# Altium schematic sheet msp430.SchDoc
size A4
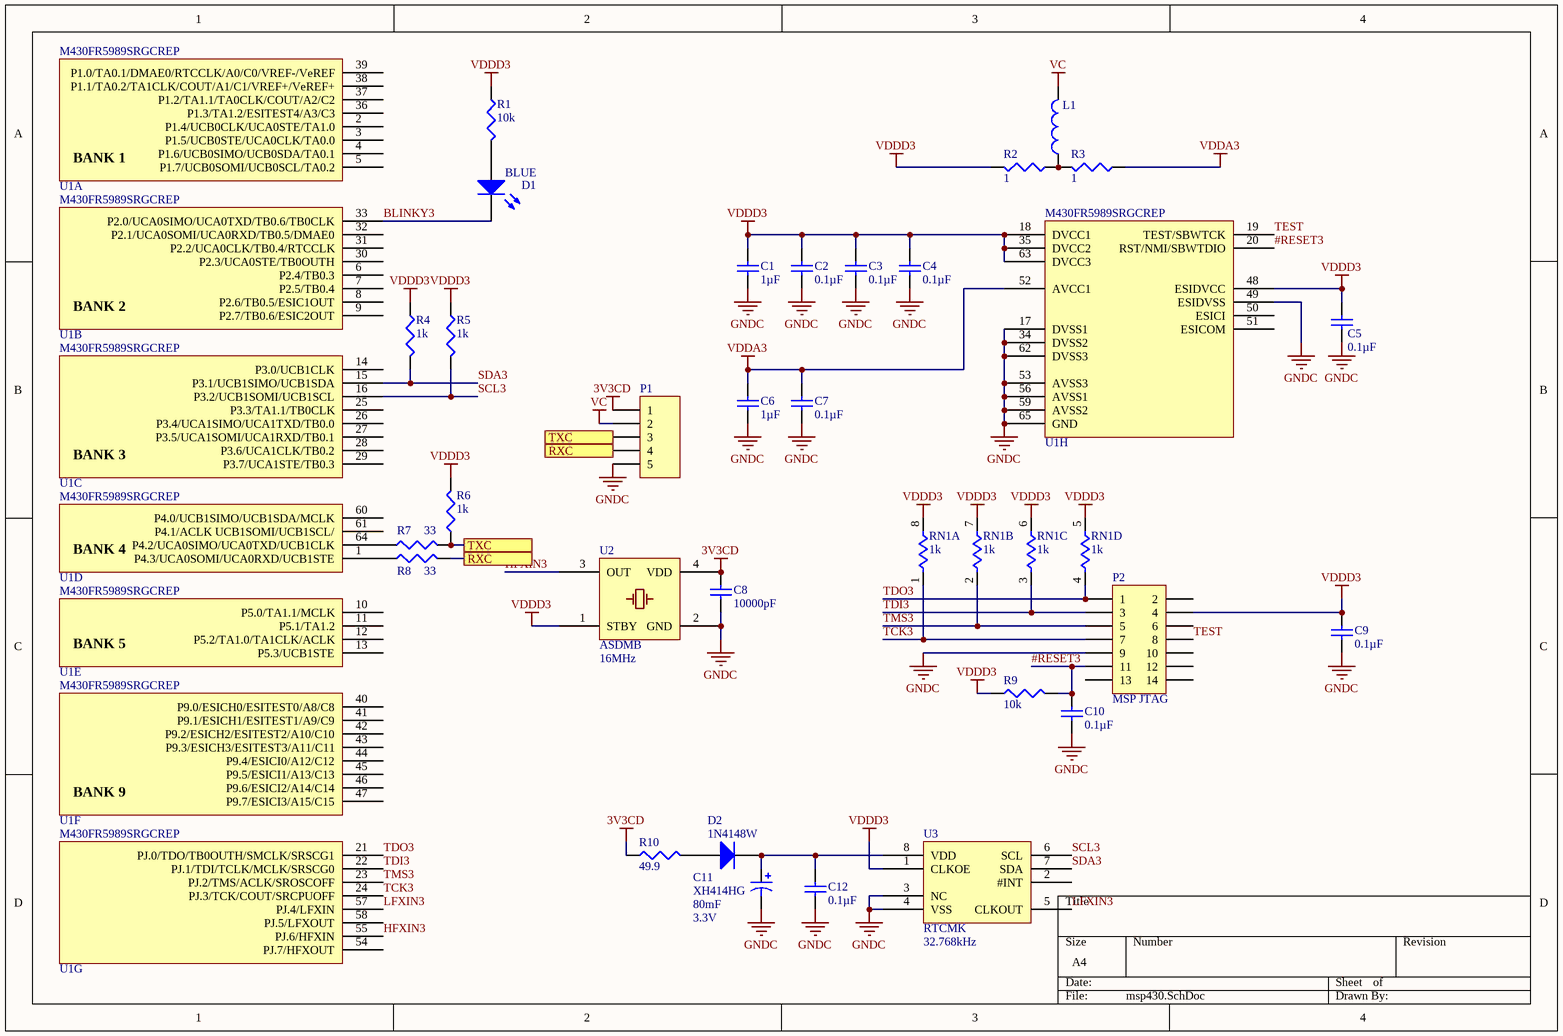
[diagram p0: msp430.SchDoc]

## Parts
C1  value 1µF  [TDK-CGA3E]  (hidden comment: Cap)
C2  value 0.1µF  [TDK-CGA3E]  (hidden comment: Cap)
C3  value 0.1µF  [TDK-CGA3E]  (hidden comment: Cap)
C4  value 0.1µF  [TDK-CGA3E]  (hidden comment: Cap)
C5  value 0.1µF  [TDK-CGA3E]  (hidden comment: Cap)
C6  value 1µF  [TDK-CGA3E]  (hidden comment: Cap)
C7  value 0.1µF  [TDK-CGA3E]  (hidden comment: Cap)
C8  value 10000pF  [TDK-CGA3E]  (hidden comment: Cap)
C9  value 0.1µF  [TDK-CGA3E]  (hidden comment: Cap)
C10  value 0.1µF  [TDK-CGA3E]  (hidden comment: Cap)
C11  XH414HG  value 80mF  Voltage - Rated: 3.3V  [SKI-XH414HG-IV01E]
C12  value 0.1µF  [TDK-CGA3E]  (hidden comment: Cap)
D1  value BLUE  [WL-150060XS75000]  (hidden comment: LED)
D2  1N4148W  [DIOD-SOD123]
L1  Inductor  [TDK-MPX1608]  (value not drawn)
P1  319-10-105-30-054000  [319-10-105-30-054000]  (value not drawn)
P2  Header 7x2  [SLN-GRPB072]  (value not drawn)
R1  value 10k  [PANA-ERJ3EK]  (hidden comment: Res3)
R2  value 1  [VSH-0603MCT]  (hidden comment: Res3)
R3  value 1  [VSH-0603MCT]  (hidden comment: Res3)
R4  value 1k  [PANA-ERJ3EK]  (hidden comment: Res3)
R5  value 1k  [PANA-ERJ3EK]  (hidden comment: Res3)
R6  value 1k  [PANA-ERJ3EK]  (hidden comment: Res3)
R7  value 33  [PANA-ERJ3EK]  (hidden comment: Res3)
R8  value 33  [PANA-ERJ3EK]  (hidden comment: Res3)
R9  value 10k  [PANA-ERJ3EK]  (hidden comment: Res3)
R10  value 49.9  [PANA-ERJ3EK]  (hidden comment: Res3)
RN1  value 1k  [PANA-EXB1206]  (hidden comment: Res4 Pack1)  (parts A,B,C,D of 4)
U1  Manufacturer Part Number: M430FR5989SRGCREP  [TI-RGC]  (hidden comment: MSP430FR5989)  (parts A,B,C,D,E,F,G,H of 8)
U2  ASDMB  value 16MHz  [ABR-ASDMB]
U3  RTCMK  value 32.768kHz  [ABR-RTCMK]

## Ports
RXC, TXC

## Nets
3V3CD: C8.2 P1.1 R10.2 U2.4(VDD)
GNDC: C1.1 C2.1 C3.1 C4.1 C5.1 C6.1 C7.1 C8.1 C9.1 C10.2 C11.2 C12.1 P1.5 P2.9 U1.17(DVSS1) U1.34(DVSS2) U1.49(ESIDVSS) U1.53(AVSS3) U1.56(AVSS1) U1.59(AVSS2) U1.62(DVSS3) U1.65(GND) U2.2(GND) U3.3(NC) U3.4(VSS)
VC: L1.2 P1.2
VDDA3: C6.2 C7.2 R3.1 U1.52(AVCC1)
VDDD3: C1.2 C2.2 C3.2 C4.2 C5.2 C9.2 P2.4 R1.2 R2.2 R4.2 R5.2 R6.2 R9.1 RN1.5 RN1.6 RN1.7 RN1.8 U1.18(DVCC1) U1.35(DVCC2) U1.48(ESIDVCC) U1.63(DVCC3) U2.1(STBY) U3.1(CLKOE)
#RESET3: C10.1 P2.11 R9.2 U1.20(RST/NMI/SBWTDIO)
BLINKY3: D1.2(K) U1.33(P2.0/UCA0SIMO/UCA0TXD/TB0.6/TB0CLK)
HFXIN3: U1.55(PJ.6/HFXIN) U2.3(OUT)
LFXIN3: U1.57(PJ.4/LFXIN) U3.5(CLKOUT)
RXC: P1.4 R8.2 ; port RXC
SCL3: R5.1 U1.16(P3.2/UCB1SOMI/UCB1SCL) U3.6(SCL)
SDA3: R4.1 U1.15(P3.1/UCB1SIMO/UCB1SDA) U3.7(SDA)
TCK3: P2.7 RN1.1 U1.24(PJ.3/TCK/COUT/SRCPUOFF)
TDI3: P2.3 RN1.3 U1.22(PJ.1/TDI/TCLK/MCLK/SRSCG0)
TDO3: P2.1 RN1.4 U1.21(PJ.0/TDO/TB0OUTH/SMCLK/SRSCG1)
TEST: P2.8 U1.19(TEST/SBWTCK)
TMS3: P2.5 RN1.2 U1.23(PJ.2/TMS/ACLK/SROSCOFF)
TXC: P1.3 R6.1 R7.2 ; port TXC
NetC11_1: C11.1 C12.2 D2.2(K) U3.8(VDD)
NetD1_1: D1.1(A) R1.1
NetD2_1: D2.1(A) R10.1
NetL1_1: L1.1 R2.1 R3.2
NetR7_1: R7.1 U1.64(P4.2/UCA0SIMO/UCA0TXD/UCB1CLK)
NetR8_1: R8.1 U1.1(P4.3/UCA0SOMI/UCA0RXD/UCB1STE)

Not connected (* = marked no-connect by the designer): P2 2 6 10 12 13 14; U1 2(P1.4/UCB0CLK/UCA0STE/TA1.0) 3(P1.5/UCB0STE/UCA0CLK/TA0.0) 4(P1.6/UCB0SIMO/UCB0SDA/TA0.1) 5(P1.7/UCB0SOMI/UCB0SCL/TA0.2) 6(P2.4/TB0.3) 7(P2.5/TB0.4) 8(P2.6/TB0.5/ESIC1OUT) 9(P2.7/TB0.6/ESIC2OUT) 10(P5.0/TA1.1/MCLK) 11(P5.1/TA1.2) 12(P5.2/TA1.0/TA1CLK/ACLK) 13(P5.3/UCB1STE) 14(P3.0/UCB1CLK) 25(P3.3/TA1.1/TB0CLK) 26(P3.4/UCA1SIMO/UCA1TXD/TB0.0) 27(P3.5/UCA1SOMI/UCA1RXD/TB0.1) 28(P3.6/UCA1CLK/TB0.2) 29(P3.7/UCA1STE/TB0.3) 30(P2.3/UCA0STE/TB0OUTH) 31(P2.2/UCA0CLK/TB0.4/RTCCLK) 32(P2.1/UCA0SOMI/UCA0RXD/TB0.5/DMAE0) 36(P1.3/TA1.2/ESITEST4/A3/C3) 37(P1.2/TA1.1/TA0CLK/COUT/A2/C2) 38(P1.1/TA0.2/TA1CLK/COUT/A1/C1/VREF+/VeREF+) 39(P1.0/TA0.1/DMAE0/RTCCLK/A0/C0/VREF-/VeREF) 40(P9.0/ESICH0/ESITEST0/A8/C8) 41(P9.1/ESICH1/ESITEST1/A9/C9) 42(P9.2/ESICH2/ESITEST2/A10/C10) 43(P9.3/ESICH3/ESITEST3/A11/C11) 44(P9.4/ESICI0/A12/C12) 45(P9.5/ESICI1/A13/C13) 46(P9.6/ESICI2/A14/C14) 47(P9.7/ESICI3/A15/C15) 50(ESICI) 51(ESICOM) 54(PJ.7/HFXOUT) 58(PJ.5/LFXOUT) 60(P4.0/UCB1SIMO/UCB1SDA/MCLK) 61(P4.1/ACLK_UCB1SOMI/UCB1SCL/); U3 2(#INT)

## Notes on the sheet
- (near P2) MSP JTAG
- (in symbol 48, part A) BANK 1
- (in symbol 48, part B) BANK 2
- (in symbol 48, part C) BANK 3
- (in symbol 48, part D) BANK 4
- (in symbol 48, part E) BANK 5
- (in symbol 48, part F) BANK 9

## Library data of the parts
C1 C6 = PC-TDK-02603: CAP CER 1UF 25V X7R 0603; Manufacturer Part Number: CGA3E1X7R1E105K080AC; Index: 2603; Designator: C?; Tolerance: ±10%; Published: 3/16/2016; LatestRevisionDate: 3/16/2016; LatestRevisionNote: ...; PackageReference: 0603 (1608 Metric); Publisher: AlbertaSat; PackageDescription: Radial Cap, Thru-Hole; 2 Leads; 0.3 in Pin Spacing; Part Number: PC-TDK-02603; Supplier Part Number 1: 445-6931-1-ND; Supplier 1: Digi-key; Supplier Link: http://www.digikey.ca/product-search/en?keywords=445-6931-1-ND; Voltage - Rated: 25V; Temperature Coefficient: X7R; Applications: Automotive
C2-C5 C7 C9 C10 C12 = PC-TDK-02272: CAP CER 0.1UF 50V X8R 0603; Manufacturer Part Number: CGA3E3X8R1H104K080AB; Index: 2272; Tolerance: ±10%; Published: 3/16/2016; LatestRevisionDate: 3/16/2016; LatestRevisionNote: ...; PackageReference: 0603 (1608 Metric); Publisher: AlbertaSat; PackageDescription: Radial Cap, Thru-Hole; 2 Leads; 0.3 in Pin Spacing; Part Number: PC-TDK-02272; Supplier Part Number 1: 445-12606-1-ND; Supplier 1: Digi-key; Supplier Link: http://www.digikey.ca/product-search/en?keywords=445-12606-1-ND; Voltage - Rated: 50V; Temperature Coefficient: X8R; Applications: Automotive
C8 = PC-TDK-01883: CAP CER 10000PF 100V C0G 0603; Manufacturer Part Number: CGA3E1C0G2A103J080AC; Index: 1883; Designator: C?; Tolerance: ±5%; Temperature Coefficient: NP0; Published: 3/16/2016; LatestRevisionDate: 3/16/2016; LatestRevisionNote: ...; PackageReference: 0603 (1608 Metric); Publisher: AlbertaSat; PackageDescription: Radial Cap, Thru-Hole; 2 Leads; 0.3 in Pin Spacing; Part Number: PC-TDK-01883; Supplier Part Number 1: 445-172688-1-ND; Supplier 1: Digi-key; Supplier Link: http://www.digikey.ca/product-search/en?keywords=445-172688-1-ND; Voltage - Rated: 100V; Applications: Automotive
C11 = PC-SKI-00001: CAP 80MF 3.3V SURFACE MOUNT; Manufacturer Part Number: XH414HG-IV01E; Index: 1; Designator: C?; Published: 2018-04-25; LatestRevisionDate: 2018-04-25; LatestRevisionNote: ...; PackageReference: 0.189" Dia (4.80mm); Publisher: AlbertaSat; PackageDescription: Polarized Capacitor (Radial); 2 Leads; Part Number: PC-SKI-00001; Supplier Part Number 1: 728-1050-1-ND; Supplier 1: Digi-key; Supplier Part Number 2: 628-XH414HG-IV01E; Supplier 2: Mouser; Supplier Link: #https://www.digikey.ca/product-detail/en/seiko-instruments/XH414HG-IV01E/728-1050-1-ND/1889211#
D1 = 4: LED BLUE CLEAR 0603 SMD; Part Number: 4; Manufacturer Part Number: 150060BS75000; Designator: D?; Brightness: 145mcd; Published: 8-Jun-2000; LatestRevisionDate: 08-Jul-2005; LatestRevisionNote: Mech Layer 1 removed.; PackageReference: WL-150060XS75000; Publisher: Altium Limited; PackageDescription: LED; 2 Leads; Supplier Part Number 1: 732-4966-1-ND; Supplier 1: Digi-Key; Supplier Link: http://www.digikey.ca/product-search/en?keywords=732-4966-1-ND
D2 = 26: DIODE GEN PURP 100V 300MA SOD123; Part Number: 26; Manufacturer Part Number: 1N4148W-7-F; Designator: D?; Voltage - DC Reverse: 1.25V @ 150mA; Published: 8-Jun-2000; LatestRevisionDate: 17-Jul-2002; LatestRevisionNote: Re-released for DXP Platform.; PackageVersion: Sep-1996; PackageReference: DIOD-SOD123; Publisher: Altium Limited; PackageDescription: DO-214-AB/SMC; 2 C-Bend Leads; Body 7.9 x 5.9 mm, inc. leads (LxW); Code_JEDEC: DO-214-AB; Supplier Part Number 1: 1N4148W-FDICT-ND; Supplier 1: Digi-Key; Supplier Link: #https://www.digikey.ca/product-detail/en/diodes-incorporated/1N4148W-7-F/1N4148W-FDICT-ND/815280#; Voltage - Reverse Standoff (Typ): 100V; Current - Peak Pulse: 300mA
L1 = PL-TDK-02954: FERRITE BEAD 1 KOHM 0603 1LN; Manufacturer Part Number: MPZ1608S102ATD25; Code_IEC: 1608; Value: 1 kOhm @ 100MHz; Index: 2954; Designator: L?; Current - Rated: 800mA; Published: 7/8/2017; LatestRevisionDate: 7/8/2017; LatestRevisionNote: ...; PackageReference: 0603 (1608 Metric); Publisher: AlbertaSat; PackageDescription: Chip Inductor, 2-Leads, Body 1.60x0.80mm, IPC Low Density; Code_JEITA: 0603; Part Number: PL-TDK-02954; Supplier Part Number 1: 445-172890-1-ND; Supplier 1: Digi-key; Supplier Part Number 2: 810-MPZ1608S102ATD25; Supplier 2: Mouser; Supplier Link: #https://www.digikey.ca/product-detail/en/tdk-corporation/MPZ1608S102ATD25/445-172890-1-ND/5040521#; Applications: Automotive
P1 = PP-MMM-00002: LOW PROFILE SLC TARGET CONNECTOR; Index: 2; Designator: P?; LatestRevisionDate: 2018-05-10; LatestRevisionNote: ...; Publisher: AlbertaSat; Part Number: PP-MMM-00002; Manufacturer Part Number: 319-10-105-30-054000; Supplier Part Number 1: ED10781-ND; Supplier 1: Digi-key; Supplier Part Number 2: 575-3191010530054000; Supplier 2: Mouser; Published: 2018-05-10; Supplier Link: #https://www.digikey.ca/product-detail/en/mill-max-manufacturing-corp/319-10-105-30-054000/ED10781-ND/6243896#
P2 = PP-SLN-00019: CONN HEADER .050"" 14PS DL PCB AU; Manufacturer Part Number: GRPB072VWVN-RC; Index: 19; Designator: P?; Number of Positions: 14; Pitch: 0.050" (1.27mm); LatestRevisionDate: 2016-03-16; LatestRevisionNote: ...; Publisher: AlbertaSat; Part Number: PP-SLN-00019; Supplier Part Number 1: S9015E-07-ND; Supplier 1: Digi-key; Published: 2016-03-16; PackageReference: SLN-GRPB072; PackageDescription: CONN HEADER .050"" 14PS DL PCB AU; Supplier Link: http://www.digikey.ca/product-search/en?keywords=S9015E-07-ND; Number of Rows: 2
R1 R9 = 17203: RES SMD 10K OHM 1% 1/10W 0603; Part Number: 17203; Manufacturer Part Number: ERJ-3EKF1002V; Designator: R?; Power: 0.1W, 1/10W; Temperature Coefficient: ±100ppm/°C; Published: 8-Jun-2000; LatestRevisionDate: 29-May-2009; LatestRevisionNote: IPC-7351 Footprint Added.; PackageReference: 0603 (1608 Metric); Publisher: Altium Limited; PackageDescription: Chip Resistor, 2-Leads, Body 1.60x0.80mm, IPC Low Density; Supplier Part Number 1: P10.0KHCT-ND; Supplier 1: Digi-Key; Supplier Link: http://www.digikey.ca/product-search/en?keywords=P10.0KHCT-ND; Tolerance: ±1%
R2 R3 = PR-VSH-00048: RES SMD 1 OHM 1% 1/8W 0603; Manufacturer Part Number: MCT06030C1008FP500; Index: 4; Designator: R?; Temperature Coefficient: ±50ppm/°C; Published: 3/14/2016; LatestRevisionDate: 3/14/2016; LatestRevisionNote: ...; PackageReference: 0603 (1608 Metric); Publisher: AlbertaSat; PackageDescription: Chip Resistor, 2-Leads, Body 1.55x0.85mm, IPC Low Density; Part Number: PR-VSH-00048; Supplier Part Number 1: MCT0603-1.00-CFCT-ND; Supplier 1: Digi-key; Supplier Link: http://www.digikey.ca/product-search/en?keywords=MCT0603-1.00-CFCT-ND; Tolerance: ±1%; Power - Rated: 1/8W; Applications: General Purpose
R4-R6 = 15398: RES SMD 1K OHM 1% 1/10W 0603; Part Number: 15398; Manufacturer Part Number: ERJ-3EKF1001V; Designator: R?; Power: 0.1W, 1/10W; Temperature Coefficient: ±100ppm/°C; Published: 8-Jun-2000; LatestRevisionDate: 29-May-2009; LatestRevisionNote: IPC-7351 Footprint Added.; PackageReference: 0603 (1608 Metric); Publisher: Altium Limited; PackageDescription: Chip Resistor, 2-Leads, Body 1.60x0.80mm, IPC Low Density; Supplier Part Number 1: P1.00KHCT-ND; Supplier 1: Digi-Key; Supplier Link: http://www.digikey.ca/product-search/en?keywords=P1.00KHCT-ND; Tolerance: ±1%
R7 R8 = 13588: RES SMD 33 OHM 1% 1/10W 0603; Part Number: 13588; Manufacturer Part Number: ERJ-3EKF33R0V; Designator: R?; Power: 0.1W, 1/10W; Temperature Coefficient: ±100ppm/°C; Published: 8-Jun-2000; LatestRevisionDate: 29-May-2009; LatestRevisionNote: IPC-7351 Footprint Added.; PackageReference: 0603 (1608 Metric); Publisher: Altium Limited; PackageDescription: Chip Resistor, 2-Leads, Body 1.60x0.80mm, IPC Low Density; Supplier Part Number 1: P33.0HCT-ND; Supplier 1: Digi-Key; Supplier Link: http://www.digikey.ca/product-search/en?keywords=P33.0HCT-ND; Tolerance: ±1%
R10 = 13734: RES SMD 49.9 OHM 1% 1/10W 0603; Part Number: 13734; Manufacturer Part Number: ERJ-3EKF49R9V; Designator: R?; Power: 0.1W, 1/10W; Temperature Coefficient: ±100ppm/°C; Published: 8-Jun-2000; LatestRevisionDate: 29-May-2009; LatestRevisionNote: IPC-7351 Footprint Added.; PackageReference: 0603 (1608 Metric); Publisher: Altium Limited; PackageDescription: Chip Resistor, 2-Leads, Body 1.60x0.80mm, IPC Low Density; Supplier Part Number 1: P49.9HCT-ND; Supplier 1: Digi-Key; Supplier Link: http://www.digikey.ca/product-search/en?keywords=P49.9HCT-ND; Tolerance: ±1%
RN1 = 19830: RES ARRAY 4 RES 1K OHM 1206; Part Number: 19830; Manufacturer Part Number: EXB-38V102JV; Sim Note: Enter the Resistance value into parameter field.; Designator: RN?; Tolerance: ±5%; Power: 62.5mW; Temperature Coefficient: ±200ppm/°C; Code_JEDEC: MS-012-AC; Supplier Part Number 1: Y9102CT-ND; Supplier 1: Digi-Key; Supplier Link: http://www.digikey.ca/product-search/en?keywords=Y9102CT-ND; PackageReference: 1206 (3216 Metric), Convex, Long Side Terminals; PackageDescription: Chip Array, ConvexS, 8-Leads, Pitch 0.80mm,  Body 3.20x1.60mm,  IPC Low Density
U1 = 48: IC MCU 16BIT 128KB FRAM 64VQFN; Part Number: 48; Core Processor: CPUXV2; Core Size: 16-Bit; Speed: 16MHz; Program Memory Size: 128KB (128K x 8); RAM Size: 2K x 8; Supplier Part Number 2: M430FR5989SRGCREP; Supplier 2: Texas Instruments; Supplier Part Number 1: M430FR5989SRGCREP-ND; Supplier 1: Digi-Key; Supplier Link: #https://www.digikey.ca/products/en?keywords=M430FR5989SRGCREP#; PackageReference: TI-64QFN; Operating Temperature: -40°C ~ 105°C (TA)
U2 = PU-ABR-00014: OSC MEMS 16.000MHZ CMOS SMD; Manufacturer Part Number: ASDMB-16.000MHZ-XY-T; Index: 14; Designator: U?; Tolerance: ±10ppm; Part Number: PU-ABR-00014; Supplier Part Number 1: 535-11457-1-ND; Supplier 1: Digi-key; Supplier Part Number 2: 815-ASDMB-16-XY-T; Supplier 2: Mouser; Publisher: AlbertaSat; Published: 2017-10-24; LatestRevisionDate: 2017-10-24; LatestRevisionNote: ...; PackageReference: 4-SMD, No Lead; PackageDescription: DFN, 4-Leads, Body 2.00x2.50mm, Pitch 1.65mm, IPC Low Density; Supplier Link: http://www.digikey.ca/product-search/en?keywords=535-11457-1-ND
U3 = PU-ABR-00037: IC RTC CLK/CALENDAR I2C 8-SMT; Manufacturer Part Number: AB-RTCMK-32.768KHZ-T3; Index: 37; Designator: U?; Part Number: PU-ABR-00037; Supplier Part Number 1: 535-11916-1-ND; Supplier 1: Digi-key; Supplier Part Number 2: 815-AB-RTCMK-32.7KT3; Supplier 2: Mouser; Publisher: AlbertaSat; Published: 4/23/2018; LatestRevisionDate: 4/23/2018; LatestRevisionNote: ...; PackageReference: 8-SMD Module; PackageDescription: 8-SMD Module; Supplier Link: https://www.digikey.ca/product-detail/en/abracon-llc/AB-RTCMK-32.768KHZ-T3/535-11916-1-ND/3601050